# Altium schematic sheet wheelmotor_connections.SchDoc
size A4
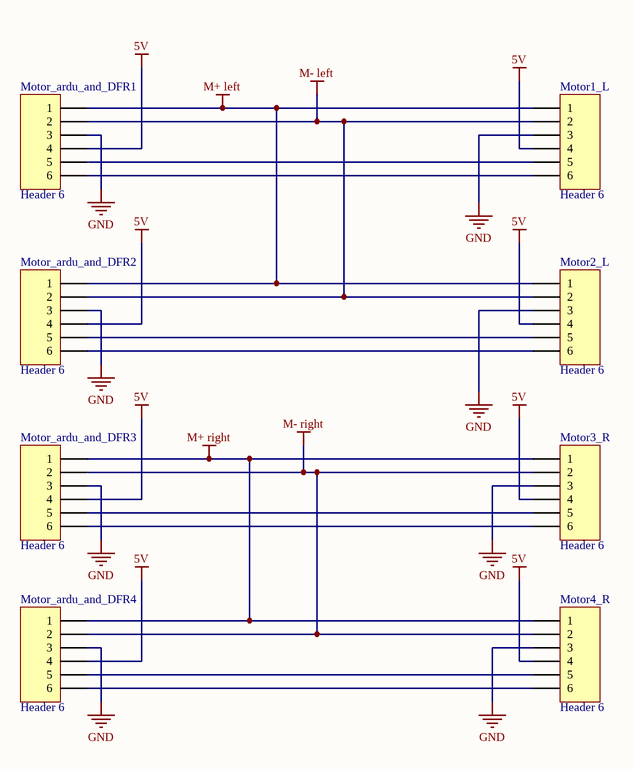
[diagram p0: wheelmotor_connections.SchDoc]

## Parts
Motor1_L  Header 6  [HDR1X6]
Motor2_L  Header 6  [HDR1X6]
Motor3_R  Header 6  [HDR1X6]
Motor4_R  Header 6  [HDR1X6]
Motor_ardu_and_DFR1  Header 6  [HDR1X6]
Motor_ardu_and_DFR2  Header 6  [HDR1X6]
Motor_ardu_and_DFR3  Header 6  [HDR1X6]
Motor_ardu_and_DFR4  Header 6  [HDR1X6]

## Nets
5V: Motor1_L.4 Motor2_L.4 Motor3_R.4 Motor4_R.4 Motor_ardu_and_DFR1.4 Motor_ardu_and_DFR2.4 Motor_ardu_and_DFR3.4 Motor_ardu_and_DFR4.4
GND: Motor1_L.3 Motor2_L.3 Motor3_R.3 Motor4_R.3 Motor_ardu_and_DFR1.3 Motor_ardu_and_DFR2.3 Motor_ardu_and_DFR3.3 Motor_ardu_and_DFR4.3
M+ left: Motor1_L.1 Motor2_L.1 Motor_ardu_and_DFR1.1 Motor_ardu_and_DFR2.1
M+ right: Motor3_R.1 Motor4_R.1 Motor_ardu_and_DFR3.1 Motor_ardu_and_DFR4.1
M- left: Motor1_L.2 Motor2_L.2 Motor_ardu_and_DFR1.2 Motor_ardu_and_DFR2.2
M- right: Motor3_R.2 Motor4_R.2 Motor_ardu_and_DFR3.2 Motor_ardu_and_DFR4.2
NetMotor1_L_5: Motor1_L.5 Motor_ardu_and_DFR1.5
NetMotor1_L_6: Motor1_L.6 Motor_ardu_and_DFR1.6
NetMotor2_L_5: Motor2_L.5 Motor_ardu_and_DFR2.5
NetMotor2_L_6: Motor2_L.6 Motor_ardu_and_DFR2.6
NetMotor3_R_5: Motor3_R.5 Motor_ardu_and_DFR3.5
NetMotor3_R_6: Motor3_R.6 Motor_ardu_and_DFR3.6
NetMotor4_R_5: Motor4_R.5 Motor_ardu_and_DFR4.5
NetMotor4_R_6: Motor4_R.6 Motor_ardu_and_DFR4.6

## Notes on the sheet
- Title
- Size:
- Date:
- A4
- Number:
- Time:
- Revision:
- Sheet
- of
- File:

## Library data of the parts
Motor1_L Motor2_L Motor3_R Motor4_R Motor_ardu_and_DFR1-Motor_ardu_and_DFR4 = Header 6: Header, 6-Pin; LatestRevisionDate: 17-Jul-2002; LatestRevisionNote: Re-released for DXP Platform.; Publisher: Altium Limited